# EAGLE schematic untitled (EAGLE 8.4.1)
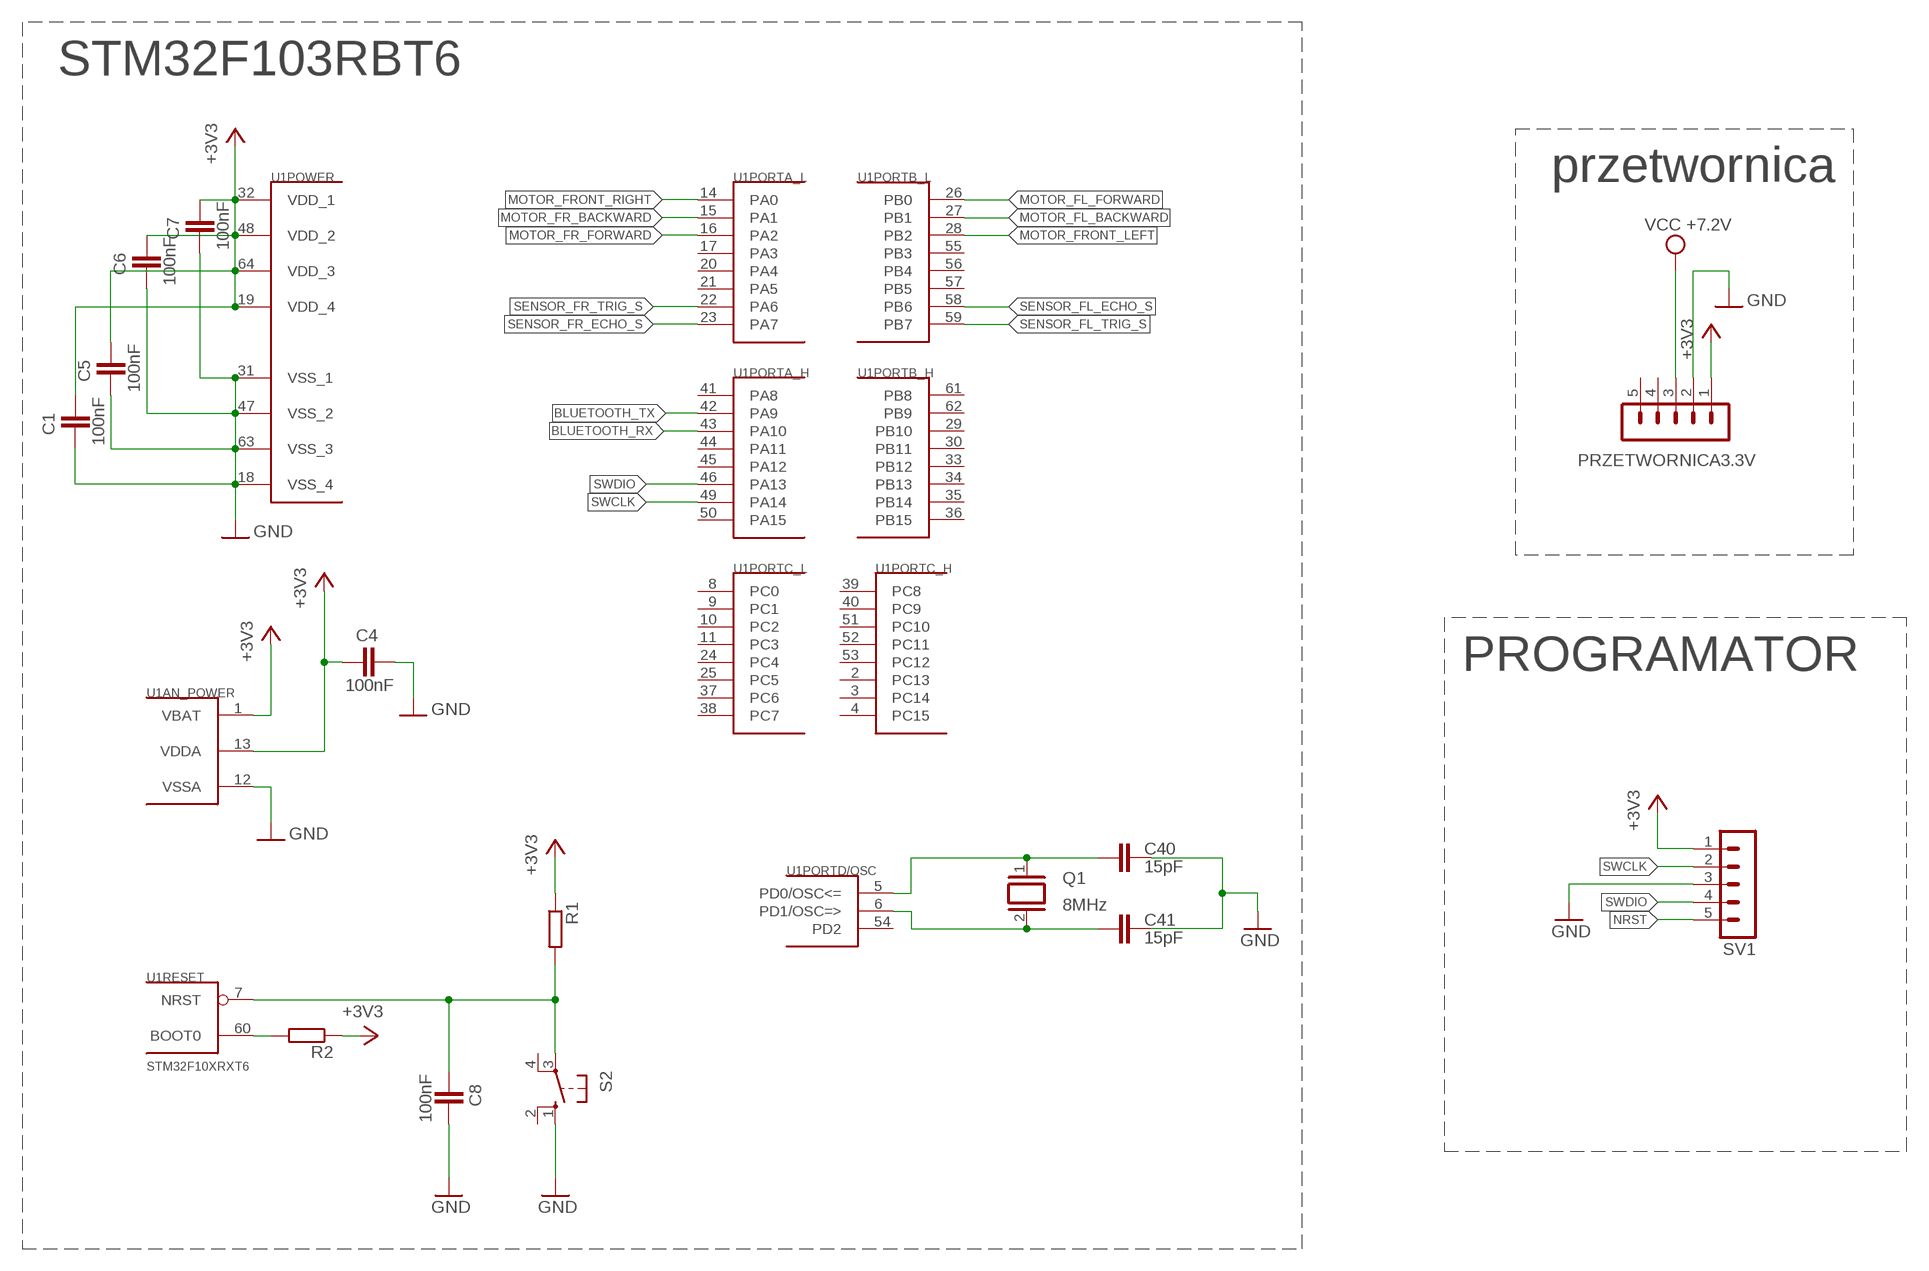
[diagram p0: schematic, sheet 1, part 1 of 2]
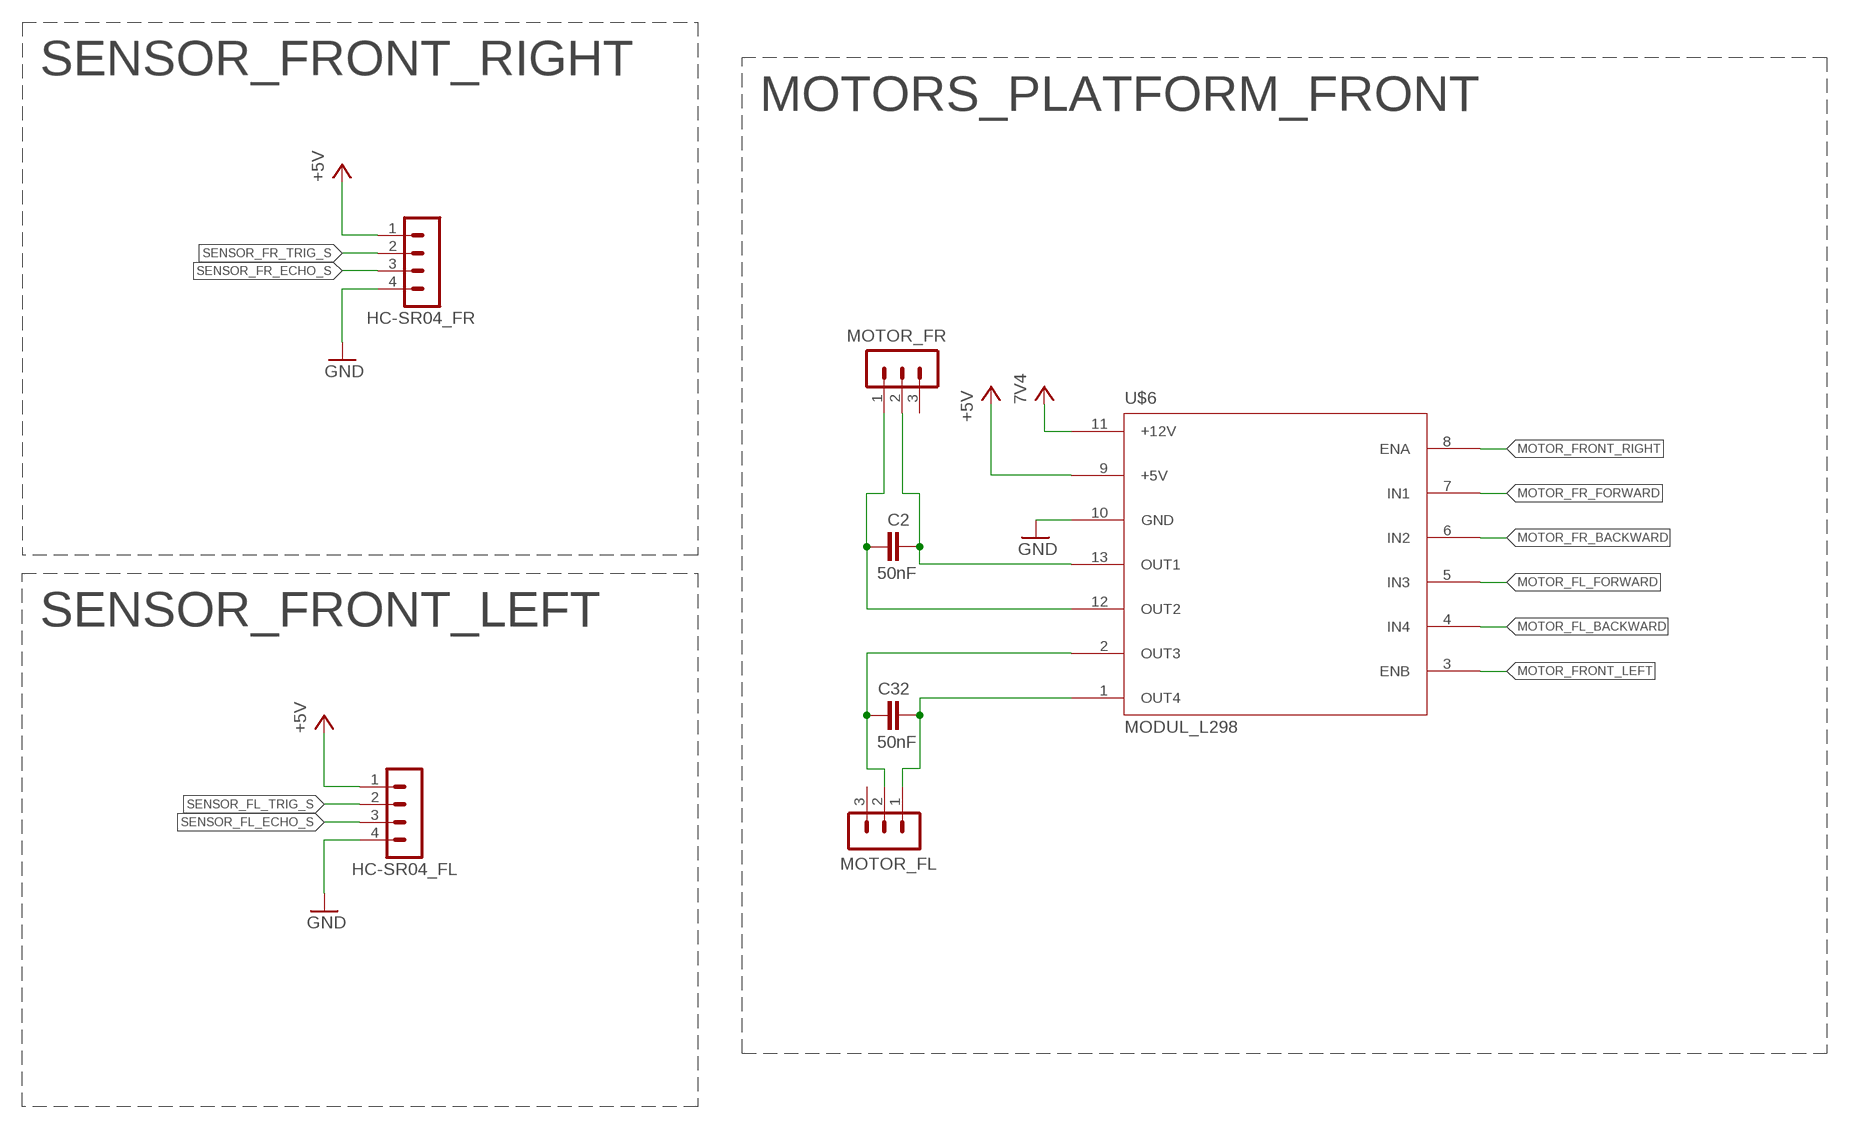
[diagram p1: schematic, sheet 1, part 2 of 2]

## Parts
C1  100nF  C-EUC0603K  [C0603K]
C2  50nF  C-EU025-024X044  [C025-024X044]
C4  100nF  C-EUC0603K  [C0603K]
C5  100nF  C-EUC0603K  [C0603K]
C6  100nF  C-EUC0603K  [C0603K]
C7  100nF  C-EUC0603K  [C0603K]
C8  100nF  C-EUC0603K  [C0603K]
C32  50nF  C-EU025-024X044  [C025-024X044]
C40  15pF  C-EU025-024X044  [C025-024X044]
C41  15pF  C-EU025-024X044  [C025-024X044]
HC-SR04_FL  MA04-1  [MA04-1]
HC-SR04_FR  MA04-1  [MA04-1]
MOTOR_FL  MA03-1  [MA03-1]
MOTOR_FR  MA03-1  [MA03-1]
PRZETWORNICA3.3V  MA05-1  [MA05-1]
Q1  8MHz  XTAL  [Q]
R1  R-EU_R0603  [R0603]
R2  R-EU_R0603  [R0603]
S2  10-XX  [B3F-10XX]
SV1  MA05-1  [MA05-1]
U1  STM32F10XRXT6  [TQFP64]
U$6  MODUL_L298  [MODUL_L298]

## Nets
+3V3: C1.2 C4.1 C5.2 C6.2 C7.2 PRZETWORNICA3.3V.1 R1.1 R2.1 U1.1(AN_POWER:VBAT) U1.13(AN_POWER:VDDA) U1.19(POWER:VDD_4) U1.32(POWER:VDD_1) U1.48(POWER:VDD_2) U1.64(POWER:VDD_3)
+5V: SV1.1 U$6.9(+5V) ; supply symbol labelled +3V3
BLUETOOTH_RX: U1.43(PORTA_H:PA10)
BLUETOOTH_TX: U1.42(PORTA_H:PA9)
GND: C1.1 C4.2 C5.1 C6.1 C7.1 C8.2 C40.2 C41.2 HC-SR04_FL.4 HC-SR04_FR.4 PRZETWORNICA3.3V.2 S2.1(S) SV1.3 U1.12(AN_POWER:VSSA) U1.18(POWER:VSS_4) U1.31(POWER:VSS_1) U1.47(POWER:VSS_2) U1.63(POWER:VSS_3) U$6.10(GND)
MOTOR_FL_BACKWARD: U1.27(PORTB_L:PB1) U$6.4(IN4)
MOTOR_FL_FORWARD: U1.26(PORTB_L:PB0) U$6.5(IN3)
MOTOR_FR_BACKWARD: U1.15(PORTA_L:PA1) U$6.6(IN2)
MOTOR_FR_FORWARD: U1.16(PORTA_L:PA2) U$6.7(IN1)
MOTOR_FRONT_LEFT: U1.28(PORTB_L:PB2) U$6.3(ENB)
MOTOR_FRONT_RIGHT: U1.14(PORTA_L:PA0) U$6.8(ENA)
N$1: R2.2 U1.60(RESET:BOOT0)
N$2: C2.2 MOTOR_FR.2 U$6.13(OUT1)
N$3: C40.1 Q1.1 U1.5(PORTD/OSC:PD0/OSC<=)
N$4: C2.1 MOTOR_FR.1 U$6.12(OUT2)
N$14: C41.1 Q1.2 U1.6(PORTD/OSC:PD1/OSC=>)
NRST: SV1.5
OUT1: C32.2 MOTOR_FL.1 U$6.1(OUT4)
OUT2: C32.1 MOTOR_FL.2 U$6.2(OUT3)
SENSOR_FL_ECHO_S: HC-SR04_FL.3 U1.58(PORTB_L:PB6)
SENSOR_FL_TRIG_S: HC-SR04_FL.2 U1.59(PORTB_L:PB7)
SENSOR_FR_ECHO_S: HC-SR04_FR.3 U1.23(PORTA_L:PA7)
SENSOR_FR_TRIG_S: HC-SR04_FR.2 U1.22(PORTA_L:PA6)
SWCLK: SV1.2 U1.49(PORTA_H:PA14)
SWDIO: SV1.4 U1.46(PORTA_H:PA13)
VCC: HC-SR04_FL.1 HC-SR04_FR.1 PRZETWORNICA3.3V.3 U$6.11(+12V) ; supply symbol labelled VCC +7.2V, +5V, 7V4
VCC+3.3V: C8.1 R1.2 S2.3(P) U1.7(RESET:NRST)
Unconnected: MOTOR_FL.3 MOTOR_FR.3 PRZETWORNICA3.3V.4 PRZETWORNICA3.3V.5 S2.2(S1) S2.4(P1) U1.2(PORTC_H:PC13) U1.3(PORTC_H:PC14) U1.4(PORTC_H:PC15) U1.8(PORTC_L:PC0) U1.9(PORTC_L:PC1) U1.10(PORTC_L:PC2) U1.11(PORTC_L:PC3) U1.17(PORTA_L:PA3) U1.20(PORTA_L:PA4) U1.21(PORTA_L:PA5) U1.24(PORTC_L:PC4) U1.25(PORTC_L:PC5) U1.29(PORTB_H:PB10) U1.30(PORTB_H:PB11) U1.33(PORTB_H:PB12) U1.34(PORTB_H:PB13) U1.35(PORTB_H:PB14) U1.36(PORTB_H:PB15) U1.37(PORTC_L:PC6) U1.38(PORTC_L:PC7) U1.39(PORTC_H:PC8) U1.40(PORTC_H:PC9) U1.41(PORTA_H:PA8) U1.44(PORTA_H:PA11) U1.45(PORTA_H:PA12) U1.50(PORTA_H:PA15) U1.51(PORTC_H:PC10) U1.52(PORTC_H:PC11) U1.53(PORTC_H:PC12) U1.54(PORTD/OSC:PD2) U1.55(PORTB_L:PB3) U1.56(PORTB_L:PB4) U1.57(PORTB_L:PB5) U1.61(PORTB_H:PB8) U1.62(PORTB_H:PB9)

## Notes on the sheet
- STM32F103RBT6
- SENSOR_FRONT_RIGHT
- MOTORS_PLATFORM_FRONT
- przetwornica
- PROGRAMATOR | SENSOR_FRONT_LEFT

## Library data of the parts
C1 C2 C4-C8 C32 C40 C41 = rcl:C-EU: CAPACITOR, European symbol; SPICEPREFIX: C
HC-SR04_FL HC-SR04_FR = con-lstb:MA04-1: PIN HEADER; OC_FARNELL: unknown; OC_NEWARK: unknown
MOTOR_FL MOTOR_FR = con-lstb:MA03-1: PIN HEADER; OC_FARNELL: unknown; OC_NEWARK: unknown
PRZETWORNICA3.3V SV1 = con-lstb:MA05-1: PIN HEADER; OC_FARNELL: unknown; OC_NEWARK: unknown
Q1 = special:XTAL: CRYSTAL
R1 R2 = rcl:R-EU_: RESISTOR, European symbol
S2 = switch-omron:10-XX: OMRON SWITCH; MPN: B3F-1000; OC_FARNELL: 176432; OC_NEWARK: 36M3542
U1 = stm32:STM32F10XRXT6: STM32F101/103 64pin LQFP
U$6 = modul_L298:MODUL_L298